# Altium schematic sheet PPO.SchDoc
size B; Organization: Altium Limited; Address1: L3, 12a Rodborough Rd; Address2: Frenchs Forest; Address3: NSW; Address4: Australia 2086
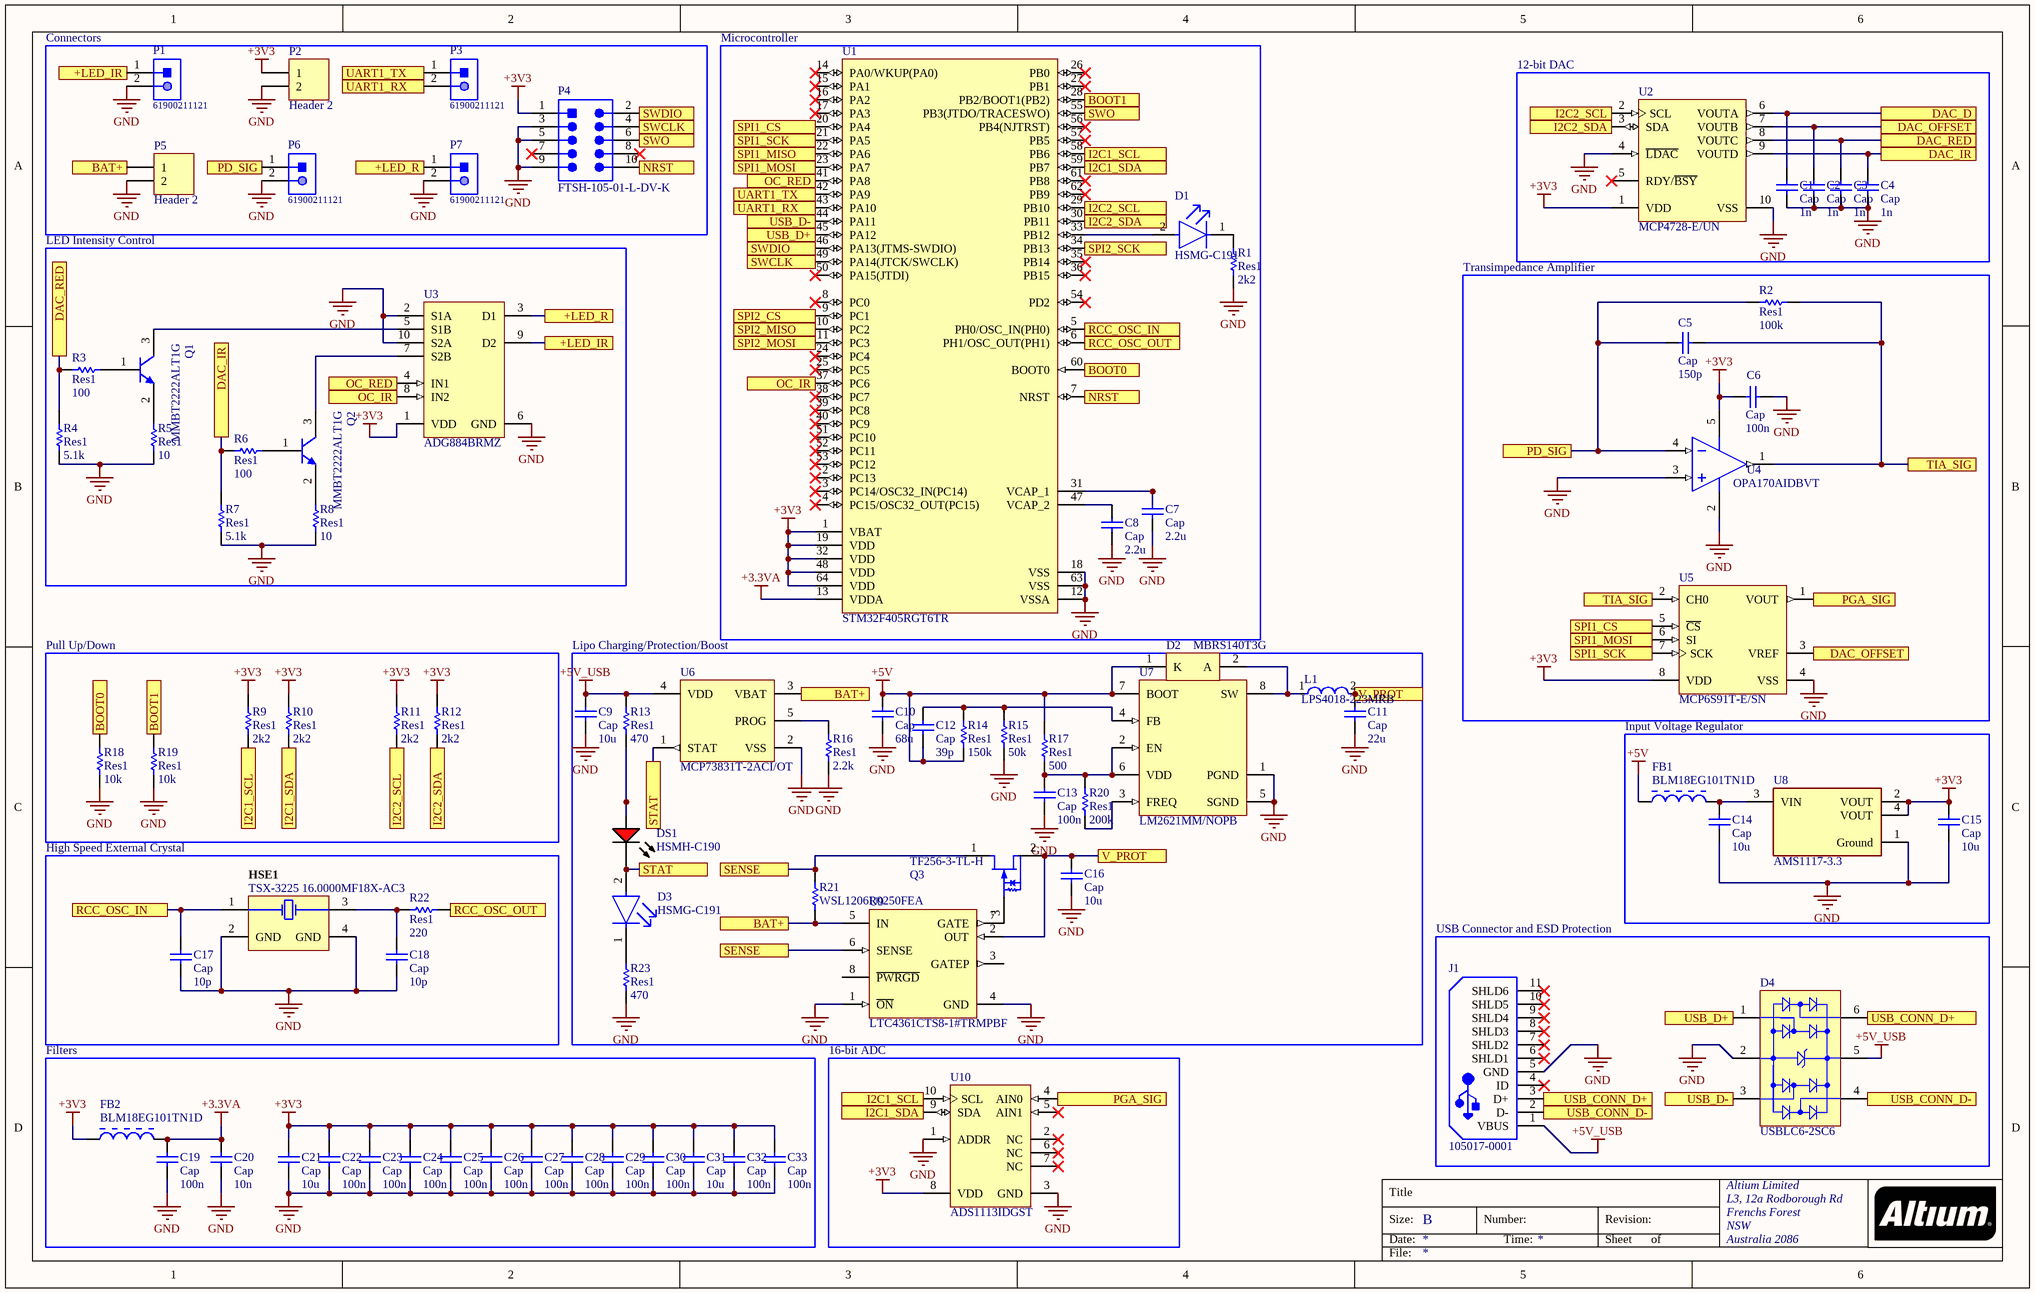
[diagram p0: PPO.SchDoc]

## Parts
C1  Cap  value 1n  [SMD-0402C]
C2  Cap  value 1n  [SMD-0402C]
C3  Cap  value 1n  [SMD-0402C]
C4  Cap  value 1n  [SMD-0402C]
C5  Cap  value 150p  [SMD-0402C]
C6  Cap  value 100n  [SMD-0402C]
C7  Cap  value 2.2u  [SMD-0402C]
C8  Cap  value 2.2u  [SMD-0402C]
C9  Cap  value 10u  [SMD-0402C]
C10  Cap  value 68u  [SMD-0402C]
C11  Cap  value 22u  [SMD-0402C]
C12  Cap  value 39p  [SMD-0402C]
C13  Cap  value 100n  [SMD-0402C]
C14  Cap  value 10u  [SMD-0402C]
C15  Cap  value 10u  [SMD-0402C]
C16  Cap  value 10u  [SMD-0402C]
C17  Cap  value 10p  [SMD-0402C]
C18  Cap  value 10p  [SMD-0402C]
C19  Cap  value 100n  [SMD-0402C]
C20  Cap  value 10n  [SMD-0402C]
C21  Cap  value 10u  [SMD-0402C]
C22  Cap  value 100n  [SMD-0402C]
C23  Cap  value 100n  [SMD-0402C]
C24  Cap  value 100n  [SMD-0402C]
C25  Cap  value 100n  [SMD-0402C]
C26  Cap  value 100n  [SMD-0402C]
C27  Cap  value 100n  [SMD-0402C]
C28  Cap  value 100n  [SMD-0402C]
C29  Cap  value 100n  [SMD-0402C]
C30  Cap  value 100n  [SMD-0402C]
C31  Cap  value 10u  [SMD-0402C]
C32  Cap  value 100n  [SMD-0402C]
C33  Cap  value 100n  [SMD-0402C]
D1  HSMG-C191  [FP-HSMG-C191-MFG]
D2  MBRS140T3G  [ONSC-SMB-2-403A-03_H_V]
D3  HSMG-C191  [FP-HSMG-C191-MFG]
D4  USBLC6-2SC6  [STM-SOT23-6L_V]
DS1  HSMH-C190  [AVAG-HSMX-C190_V]
FB1  BLM18EG101TN1D  [MURA-BLM18-RF-H3-CHIP-2_V]
FB2  BLM18EG101TN1D  [MURA-BLM18-RF-H3-CHIP-2_V]
HSE1  TSX-3225 16.0000MF18X-AC3  [EPSON-TSX-3225_V]
J1  105017-0001  [USB-MICRO-B_V]
L1  LPS4018-223MRB  [FP-LPS4018-MFG]
P1  61900211121  [61900211121]
P2  Header 2  [HDR1X2]
P3  61900211121  [61900211121]
P4  FTSH-105-01-L-DV-K  [SMTC-FTSH-105-01-L-DV-K_V]
P5  Header 2  [HDR1X2]
P6  61900211121  [61900211121]
P7  61900211121  [61900211121]
Q1  MMBT2222ALT1G  [ONSC-SOT-23-3-318-08_V]
Q2  MMBT2222ALT1G  [ONSC-SOT-23-3-318-08_V]
Q3  TF256-3-TL-H  [ONSC-USFP-3-524AC_V]
R1  Res1  value 2k2  [SMD-0402C]
R2  Res1  value 100k  [SMD-0402C]
R3  Res1  value 100  [SMD-0402C]
R4  Res1  value 5.1k  [SMD-0402C]
R5  Res1  value 10  [SMD-0402C]
R6  Res1  value 100  [SMD-0402C]
R7  Res1  value 5.1k  [SMD-0402C]
R8  Res1  value 10  [SMD-0402C]
R9  Res1  value 2k2  [SMD-0402C]
R10  Res1  value 2k2  [SMD-0402C]
R11  Res1  value 2k2  [SMD-0402C]
R12  Res1  value 2k2  [SMD-0402C]
R13  Res1  value 470  [SMD-0402C]
R14  Res1  value 150k  [SMD-0402C]
R15  Res1  value 50k  [SMD-0402C]
R16  Res1  value 2.2k  [SMD-0402C]
R17  Res1  value 500  [SMD-0402C]
R18  Res1  value 10k  [SMD-0402C]
R19  Res1  value 10k  [SMD-0402C]
R20  Res1  value 200k  [SMD-0402C]
R21  WSL1206R0250FEA  [RESC3216X89X51ML25T25]
R22  Res1  value 220  [SMD-0402C]
R23  Res1  value 470  [SMD-0402C]
U1  STM32F405RGT6TR  [STM-LQFP64_L]
U2  MCP4728-E/UN  [MSOP-UN10_N]
U3  ADG884BRMZ  [ADI-RM-10_L]
U4  OPA170AIDBVT  [DBV0005A_L]
U5  MCP6S91T-E/SN  [SOIC-SN8_N]
U6  MCP73831T-2ACI/OT  [SOT-23-OT5_M]
U7  LM2621MM/NOPB  [DGK0008A_N]
U8  AMS1117-3.3  [FP-AMS1117-IPC_C]
U9  LTC4361CTS8-1#TRMPBF  [LT-TS8-8-TSOT-23_V]
U10  ADS1113IDGST  [TI-DGS10_L]

## Blocks framed on the sheet
Connectors: P1-P7
Microcontroller: C7 C8 D1 R1 U1
12-bit DAC: C1-C4 U2
LED Intensity Control: Q1 Q2 R3-R8 U3
Transimpedance Amplifier: C5 C6 R2 U4 U5
Pull Up/Down: R9-R12 R18 R19
Lipo Charging/Protection/Boost: C9-C13 C16 D2 D3 DS1 L1 Q3 R13-R17 R20 R21 R23 U6 U7 U9
Input Voltage Regulator: C14 C15 FB1 U8
High Speed External Crystal: C17 C18 HSE1 R22
USB Connector and ESD Protection: D4 J1
Filters: C19-C33 FB2
16-bit ADC: U10

## Ports
+LED_IR, +LED_R, BAT+, BOOT0, BOOT1, DAC_D, DAC_IR, DAC_OFFSET, DAC_RED, I2C1_SCL, I2C1_SDA, I2C2_SCL, I2C2_SDA, NRST, OC_IR, OC_RED, PD_SIG, PGA_SIG, RCC_OSC_IN, RCC_OSC_OUT, SENSE, SPI1_CS, SPI1_MISO, SPI1_MOSI, SPI1_SCK, SPI2_CS, SPI2_MISO, SPI2_MOSI, SPI2_SCK, STAT, SWCLK, SWDIO, SWO, TIA_SIG, UART1_RX, UART1_TX, USB_CONN_D+, USB_CONN_D-, USB_D+, USB_D-, V_PROT

## Nets
+3.3VA: C19.2 C20.2 FB2.2 U1.13(VDDA)
+3V3: C6.2 C15.2 C21.2 C22.2 C23.2 C24.2 C25.2 C26.2 C27.2 C28.2 C29.2 C30.2 C31.2 C32.2 C33.2 FB2.1 P2.1 P4.1 R9.2 R10.2 R11.2 R12.2 U1.1(VBAT) U1.19(VDD) U1.32(VDD) U1.48(VDD) U1.64(VDD) U2.1(VDD) U3.1(VDD) U4.5(V+) U5.8(VDD) U8.2(VOUT) U8.4(VOUT) U10.8(VDD)
+5V: C10.2 C12.1 D2.1(K) FB1.1 R14.2 R17.1 U7.7(BOOT)
+5V_USB: C9.2 D4.5(VBUS) J1.1(VBUS) R13.2 U6.4(VDD)
GND: C1.1 C2.1 C3.1 C4.1 C6.1 C7.1 C8.1 C9.1 C10.1 C11.1 C13.1 C14.1 C15.1 C16.1 C17.1 C18.1 C19.1 C20.1 C21.1 C22.1 C23.1 C24.1 C25.1 C26.1 C27.1 C28.1 C29.1 C30.1 C31.1 C32.1 C33.1 D4.2(GND) HSE1.2(GND) HSE1.4(GND) J1.5(GND) P1.2 P2.2 P4.3 P4.5 P4.9 P5.2 P6.2 P7.2 R1.1 R4.1 R5.1 R7.1 R8.1 R15.2 R16.2 R18.1 R19.1 R23.2 U1.12(VSSA) U1.18(VSS) U1.63(VSS) U2.4(~{LDAC}) U2.10(VSS) U3.2(S1A) U3.6(GND) U3.10(S2A) U4.2(V-) U4.3(IN+) U5.4(VSS) U6.2(VSS) U7.1(PGND) U7.5(SGND) U8.1(Ground) U9.1(~{ON}) U9.4(GND) U10.1(ADDR) U10.3(GND)
+LED_IR: P1.1 U3.9(D2) ; port +LED_IR
+LED_R: P7.1 U3.3(D1) ; port +LED_R
BAT+: P5.1 R21.1 U6.3(VBAT) U9.5(IN) ; port BAT+
BOOT0: R18.2 U1.60(BOOT0) ; port BOOT0
BOOT1: R19.2 U1.28(PB2/BOOT1(PB2)) ; port BOOT1
DAC_D: C1.2 U2.6(VOUTA) ; port DAC_D
DAC_IR: C4.2 R6.2 R7.2 U2.9(VOUTD) ; port DAC_IR
DAC_OFFSET: C2.2 U2.7(VOUTB) U5.3(VREF) ; port DAC_OFFSET
DAC_RED: C3.2 R3.2 R4.2 U2.8(VOUTC) ; port DAC_RED
I2C1_SCL: R9.1 U1.58(PB6) U10.10(SCL) ; port I2C1_SCL
I2C1_SDA: R10.1 U1.59(PB7) U10.9(SDA) ; port I2C1_SDA
I2C2_SCL: R11.1 U1.29(PB10) U2.2(SCL) ; port I2C2_SCL
I2C2_SDA: R12.1 U1.30(PB11) U2.3(SDA) ; port I2C2_SDA
NRST: P4.10 U1.7(NRST) ; port NRST
OC_IR: U1.37(PC6) U3.8(IN2) ; port OC_IR
OC_RED: U1.41(PA8) U3.4(IN1) ; port OC_RED
PD_SIG: C5.2 P6.1 R2.2 U4.4(IN-) ; port PD_SIG
PGA_SIG: U5.1(VOUT) U10.4(AIN0) ; port PGA_SIG
RCC_OSC_IN: C17.2 HSE1.1(X1) U1.5(PH0/OSC_IN(PH0)) ; port RCC_OSC_IN
RCC_OSC_OUT: R22.2 U1.6(PH1/OSC_OUT(PH1)) ; port RCC_OSC_OUT
SENSE: Q3.1(D) R21.2 U9.6(SENSE) ; port SENSE
SPI1_CS: U1.20(PA4) U5.5(~{CS}) ; port SPI1_CS
SPI1_MISO: U1.22(PA6) ; port SPI1_MISO
SPI1_MOSI: U1.23(PA7) U5.6(SI) ; port SPI1_MOSI
SPI1_SCK: U1.21(PA5) U5.7(SCK) ; port SPI1_SCK
SPI2_CS: U1.9(PC1) ; port SPI2_CS
SPI2_MISO: U1.10(PC2) ; port SPI2_MISO
SPI2_MOSI: U1.11(PC3) ; port SPI2_MOSI
SPI2_SCK: U1.34(PB13) ; port SPI2_SCK
STAT: D3.2(A) DS1.2(K) U6.1(STAT) ; port STAT
SWCLK: P4.4 U1.49(PA14(JTCK/SWCLK)) ; port SWCLK
SWDIO: P4.2 U1.46(PA13(JTMS-SWDIO)) ; port SWDIO
SWO: P4.6 U1.55(PB3(JTDO/TRACESWO)) ; port SWO
TIA_SIG: C5.1 R2.1 U4.1(OUT) U5.2(CH0) ; port TIA_SIG
UART1_RX: P3.2 U1.43(PA10) ; port UART1_RX
UART1_TX: P3.1 U1.42(PA9) ; port UART1_TX
USB_CONN_D+: D4.6(I/O_4) J1.3(D+) ; port USB_CONN_D+
USB_CONN_D-: D4.4(I/O_3) J1.2(D-) ; port USB_CONN_D-
USB_D+: D4.1(I/O_1) U1.45(PA12) ; port USB_D+
USB_D-: D4.3(I/O_2) U1.44(PA11) ; port USB_D-
V_PROT: C11.2 C16.2 L1.2 Q3.2(S) U9.2(OUT) ; port V_PROT
NetC7_2: C7.2 U1.31(VCAP_1)
NetC8_2: C8.2 U1.47(VCAP_2)
NetC12_2: C12.2 R14.1 R15.1 U7.4(FB)
NetC13_2: C13.2 R17.2 R20.1 U7.2(EN) U7.6(VDD)
NetC14_2: C14.2 FB1.2 U8.3(VIN)
NetC18_2: C18.2 HSE1.3(X2) R22.1
NetD1_1: D1.1(C) R1.2
NetD1_2: D1.2(A) U1.33(PB12)
NetD2_2: D2.2(A) L1.1 U7.8(SW)
NetD3_1: D3.1(C) R23.1
NetDS1_1: DS1.1(A) R13.1
NetQ1_1: Q1.1(B) R3.1
NetQ1_2: Q1.2(E) R5.2
NetQ1_3: Q1.3(C) U3.5(S1B)
NetQ2_1: Q2.1(B) R6.1
NetQ2_2: Q2.2(E) R8.2
NetQ2_3: Q2.3(C) U3.7(S2B)
NetQ3_3: Q3.3(G) U9.7(GATE)
NetR16_1: R16.1 U6.5(PROG)
NetR20_2: R20.2 U7.3(FREQ)

Not connected (* = marked no-connect by the designer): J1 4(ID)* 6(SHLD1)* 7(SHLD2)* 8(SHLD3)* 9(SHLD4)* 10(SHLD5)* 11(SHLD6)*; P4 7* 8*; U1 2(PC13)* 3(PC14/OSC32_IN(PC14))* 4(PC15/OSC32_OUT(PC15))* 8(PC0)* 14(PA0/WKUP(PA0))* 15(PA1)* 16(PA2)* 17(PA3)* 24(PC4)* 25(PC5)* 26(PB0)* 27(PB1)* 35(PB14)* 36(PB15)* 38(PC7)* 39(PC8)* 40(PC9)* 50(PA15(JTDI))* 51(PC10)* 52(PC11)* 53(PC12)* 54(PD2)* 56(PB4(NJTRST))* 57(PB5)* 61(PB8)* 62(PB9)*; U2 5(RDY/~{BSY})*; U9 3(GATEP) 8(~{PWRGD}); U10 2(NC)* 5(AIN1)* 6(NC)* 7(NC)*

## Notes on the sheet
- Title
- Size:
- Date:
- B
- Number:
- Time:
- Revision:
- Sheet
- of
- File:

## Library data of the parts
C1-C33 = Cap: Capacitor; Published: 8-Jun-2000; LatestRevisionDate: 17-Jul-2002; LatestRevisionNote: Re-released for DXP Platform.; PackageReference: RAD-0.3; Publisher: Altium Limited; PackageDescription: Radial Cap, Thru-Hole; 2 Leads; 0.3 in Pin Spacing
D1 D3 = CMP-18399-000001-1: LED GREEN DIFFUSED CHIP SMD; Manufacturer: Broadcom; Viewing Angle: 170°; Max Junction Temp: +95°C; Wavelength: 572nm; Peak Emmision Wavelength: 570nm; Led Orientation: Top View; Luminous Intensity: 15mcd; Reverse Voltage: 5V; Forward Current: 20mA; Forward Voltage: 2.2V; Power Dissipation: 52mW; Ipc Land Pattern Name: DIOC16080X45; Digikey Description: LED GREEN DIFFUSED CHIP SMD; Temperature Range High: +85°C; Height: 0.7mm; Automotive: No; Footprint 0 Description: SM LED; 2 Flat Leads; Device Class L3: unset; ComponentLink2Description: Datasheet; Lead Free: Yes; Package: 0; Mouser Description: LED Uni-Color Green 570nm 2-Pin Chip LED T/R; RoHS: TRUE; Category: Diode; Manufacturer Part Number: HSMG-C191; Device Class L1: Optoelectronics; Temperature Range Low: -40°C; Device Class L2: LEDs; Colour: Green; Octopart: https://octopart.com/hsmg-c191-broadcom-71131308; Temperature: -40°C to +85°C; ComponentLink2URL: https://docs.broadcom.com/docs/AV02-0551EN
D2 = CMP-1055-00347-1: Schottky Power Rectifier, 2-Pin SMB, Pb-Free, Tape and Reel; Manufacturer: On Semiconductor; Configuration: Single; IFSM Max (A): 40; PackageDescription: 2-Pin Small Molded Package, J-Bend Lead, Body 4.33 x 3.625 mm; PartNumber: MBRS140T3G; PackageReference: SMB-2-403A-03_H; ComponentLink1URL: http://www.onsemi.com/; ComponentLink2URL: http://www.onsemi.cn/pub_link/Collateral/MBRS140T3-D.PDF; PackageVersion: Rev. H, 05/2011; ComponentLink3URL: http://www.onsemi.com/pub_link/Collateral/1SMB5913BT3-D.PDF; Packing: Tape and Reel; ComponentLink1Description: Manufacturer URL; DatasheetVersion: Rev. 9; Mounting Technology: Surface Mount; RoHS: TRUE; ComponentLink3Description: Package Specification; ComponentLink2Description: Datasheet
D4 = CMP-2000-05378-1: Very low capacitance ESD protection, 3.5 pF, -40 to 125 degC, 6-Pin SOT23, RoHS, Tape and Reel; Manufacturer: STMicroelectronics; Polarity: Uni-Directional; Clamping Voltage: 17V; Rad Hardened: No; Product Height (mm): 1.3mm; Leakage Current (Max): 0.15uA; Product Length (mm): 3.05mm; Number of Elements: 1; Peak Pulse Current: 5A; Configuration: Dual; Reverse Breakdown Voltage: 6V; Working Voltage (Max): 5V; Capacitance Value: 3.5pF; Suppressor Type: DiodeArrays; Product Depth (mm): 1.75mm; Test Current (It): 1mA; Package / Case: SOT-23; Operating Temperature Max Deg. C: 125C; Package Description: 6-Pin Small Outline Transistor, Body 2.925 x 1.625 mm, Pitch 0.95 mm; Package Reference: SOT23-6L; Datasheet Version: Rev. 5, 10/2011; Operating Temperature Min Deg. C: -40C; Mounting Style: SurfaceMount; Direction Type: Uni-Directional; Mounting: SurfaceMount; Pin Count: 6; Leakage Current: 0.15uA; Packaging: TapeandReel; Operating Temperature Classification: Automotive; Clamping Voltage (Max): 17V; Manufacturer URL: http://www.st.com/; Reverse Stand-off Voltage: 5V; Datasheet URL: http://www.st.com/st-web-ui/static/active/en/resource/technical/document/datasheet/CD00050750.pdf; Working Voltage: 5V; Operating Temp Range: -40Cto125C
DS1 = CMP-1744-00004-1: LED Uni-Color Red, 65 mW, 20 mA, -40 to 85 degC, 2-Pin SMD, RoHS, Tape and Reel; Connector Type: USB; Gender: Male; Current Rating: 1 A; Length: 7.5 mm; Lead Pitch: 0.65 mm; PackageReference: HSMX-C190; Package Quantity: 2000; Max Operating Temperature: 85 degC; PackageDescription: 2-Pin Surface Mount Device, Body 1.6 x 0.8 mm, Height 0.9 mm; ComponentLink3Description: Package Specification; Mount: Surface Mount; Min Operating Temperature: -30 degC; ComponentLink3URL: http://www.fairchildsemi.com/dwg/MA/MA03D.pdf; ComponentLink1Description: Manufacturer URL; Contact Material: Copper; Pins: 5; Width: 5.6 mm; ComponentLink2Description: Datasheet; RoHSCompliant: true; DatasheetVersion: Mar-12; Height: 2.8 mm; Packaging: Tape and Reel; Contact Plating: Gold; ComponentLink1URL: http://www.avagotech.com/; REACH SVHC: No SVHC; ComponentLink2URL: http://docs.avagotech.com/docs/AV02-0551EN
FB1 FB2 = CMP-0686-00530-2: Chip Ferrite Bead for GHz Band General Use (Low DC Resistance Type), 100 Ohm, 2000 mA, -55 to 125 degC, 1.6 x 0.8 x 0.65 mm SMD, Tape and Reel; Manufacturer: Murata; Rated Current: 2000 mA; Impedance (at 100 MHz): 100 Ohm +/- 25%; DC Resistance: 0.045 Ohm Max.; ComponentLink3Description: Package Specification; ComponentLink2URL: http://www.murata.com/products/catalog/pdf/c31e.pdf; DatasheetVersion: 08/2013; ComponentLink1Description: Manufacturer URL; Packing: Tape and Reel; PackageDescription: 2-Pin Chip, Body 1.6 x 0.8 mm; Operating Temperature Range: -55 to 125 degC; ComponentLink1URL: http://www.murata.com/; ComponentLink2Description: Datasheet; Mounting Technology: Surface Mount; PartNumber: BLM18EG101TN1D; ComponentLink3URL: http://www.murata.com/products/catalog/pdf/c31e.pdf; PackageReference: BLM18_H650-2
HSE1 = CMP-2000-07332-1: MHz Range Crystal Unit, 16 MHz, -40 to 85 degC, 4-Pin SMD, RoHS, Tape and Reel; Manufacturer: Epson; Unit Weight: 0.000564oz; Tolerance: 10PPM; ESR: 60Ohms; Frequency: 16MHz; Drive Level: 200uW; Brand: EpsonTiming; Load Capacitance: 9pF; Product Category: Crystals; Packaging: Reel; Termination Style: SMD/SMT; Width: 2.5mm; Length: 3.2mm; Type: Crystal; Datasheet Version: 12/2015; Factory Pack Quantity: 250; Package Description: 4-Pin Surface Mount Device, Body 3.2 x 2.5 mm; Package / Case: 3.2mmx2.5mm; Mounting Style: SMD/SMT; Series: TSX-3225; Frequency Stability: 10PPM; Package Reference: TSX-3225; Mounting Technology: SurfaceMount; RoHS: True; Height: 0.6mm; Datasheet URL: https://support.epson.biz/td/api/doc_check.php?dl=brief_FA-238V_en.pdf; Operating Temperature Range: -40Cto+85C; Manufacturer URL: https://www.eea.epson.com/
J1 = CMP-2000-05827-1: Micro-USB B Receptacle, Right Angle, Bottom Mount, Surface Mount, with Solder Tabs, -30 to 85 degC, 5-Pin USB, RoHS, Tape and Reel; Manufacturer: Molex; Featured Product: Micro-USBConnectorsUSBConnectors; Other Names: WM1399DKR; Package Version: Rev. F, 12/2012; Number of Contacts: 5; Connector Type: USB-microB; Catalog Drawings: 1050170001; 3D Model: 105017-0001.stp; Mating Products: WM17145-ND-CABLEMICROUSBBTOSTDA1.0MWM17147-ND-CABLEMICROUSBBTOSTDA2.0MWM17146-ND-CABLEMICROUSBBTOSTDA1.5M; PCN Assembly/Origin: ResinSupplier21/Oct/2015; Voltage - Max: 30V; Online Catalog: Molex-MicroUSB; Manufacturer URL: http://www.molex.com/; Package Description: 5-Leads USB, Micro B, Body 7.5 x 5 mm, Pitch 0.65 mm; Datasheet URL: http://www.molex.com/elqNow/elqRedir.htm?ref=http://www.molex.com/webdocs/datasheets/pdf/en-us/1050170001_IO_CONNECTORS.pdf; Ingress Protection: -; Datasheet Version: 03/2016; Mounting Type: BoardCutout,SurfaceMount,RightAngle; Circuits: 5; Standard Package: 1; Package Reference: MICRO-B; Package URL: http://www.molex.com/pdm_docs/sd/1050170001_sd.pdf; Category: Connectors,Interconnects; Series: -; RoHS Information: 1050170001CertofCompliance; Features: Shielded,SolderRetention; Family: USB,DVI,HDMIConnectors; Specifications: -; Gender: Receptacle; Packaging: Digi-Reel®; Mounting Technology: SurfaceMount
L1 = CMP-11268-000004-1: Power inductor, shielded, 20/30% tol, SMT, RoHS, lead-free, halogen-free; Manufacturer: Coilcraft; Inductance: 22uH; Series Resistance: 0.36Ω; Test Frequency: 1MHz; Self Resonant Frequency: 26MHz; Tolerance: 20%; Core Material: Ferrite; Value: 22uH; Automotive Grade: Grade 3; Rms Current: 0.9A; Saturation Current: 0.8A; Shielding: true; RoHS: TRUE; Device Class L3: Fixed Inductors; Category: Ind; Lead Free: Yes; ComponentLink2URL: https://www.coilcraft.com/pdfs/lps4018.pdf; Height: 1.8mm; Mouser Description: Power inductor, shielded, 20/30% tol, SMT, RoHS, lead-free, halogen-free; Ambient Temperature Range High: +85°C; Ambient Temperature Range Low: -40°C; Manufacturer Part Number: LPS4018-223MRB; Device Class L2: Inductors; Package: LPS4018; Device Class L1: Passive Components; Octopart: https://octopart.com/lps4018-223mrb-coilcraft-30061092; ComponentLink2Description: Datasheet; Automotive: Yes
P1 P3 P6 P7 = CMP-1502-00584-1: Male Locking Header WR-WTB, THT, Vertical, pitch 2.54 mm, 1 x 2 position; Manufacturer: Wurth Elektronik; Position: 1x2; Contact Resistance: 20mOhm; Working Voltage: 250VAC; Pitch: 2.54mm; Gender: Male; Part Number: 61900211121; Mounting Technology: THT; Operating Temperature: -40to105degC; Orientation: Vertical; Packaging: Bag; Package Reference: 61900211121; Manufacturer URL: http://www.we-online.de; Datasheet URL: https://katalog.we-online.de/em/datasheet/6190xx11121.pdf; Publisher: WurthElektronik
P2 P5 = Header 2: Header, 2-Pin; LatestRevisionDate: 17-Jul-2002; LatestRevisionNote: Re-released for DXP Platform.; Publisher: Altium Limited
P4 = CMP-2000-05353-1: Male Header, Pitch 1.27 mm, 2 x 5 Position, Height 6.25 mm; Manufacturer: Samtec; Pitch: 0.050"(1.27mm); Other Names: Q3937619; Number of Positions: 10; Mating Products: SFMC-105-L2-S-D-TR-ND / -CONN.05"SURFACE10POSSMT / FLE-105-01-G-DV-TR-ND / -CONNSKT1.27MM10POSDUALSMD / FLE-105-01-G-DV-A-P-ND / -CONNSKT1.27MM10POSDUALSMD / FLE-105-01-G-DV-A-ND / -CONNSKT1.27MM10POSDUALSMD / CLP-105-02-G-D-P-TR-ND / -CONNRCPT10POSDUAL.05"SMD / SAM1155-05-ND / -CONNRCPT10POSDUAL.05"SMD / SAM1154-05-ND / -CONNRCPT10POSDUAL.05"SMD / SAM1153-05-ND / -CONNRCPT10POSDUAL.05"SMD / SAM1226-05-ND / -CONNRCPT.05"10POSDUALSMD; Number of Positions Loaded: All; Connector Type: Header,Unshrouded; Product Training Modules: Board-to-BoardConnectors; Datasheet Version: Rev. ET, 10/1995; Number of Rows: 2; Standard Package: 1; Package Description: Male Header, Pitch 1.27 mm, 2 x 5 Position, Height 5.97 mm, Tail Length 4.32 mm; Contact Finish Thickness: 10µin(0.25µm); Series: FTSH; Termination: Solder; Contact Type: MalePin; Color: Black; Package Reference: FTSH-105-01-L-DV-K; Family: RectangularConnectors-Headers,MalePins; Package URL: http://suddendocs.samtec.com/prints/ftsh-1xx-xx-xxx-dv-xxx-footprint.pdf; Packaging: Tube; Mounting Type: SurfaceMount; Category: Connectors,Interconnects; Datasheet URL: http://suddendocs.samtec.com/prints/ftsh-1xx-xx-xxx-dv-xxx-mkt.pdf; Row Spacing: 0.050"(1.27mm); Manufacturer URL: http://www.samtec.com/; Contact Mating Length: 0.120"(3.05mm); Contact Finish: Gold
Q1 Q2 = CMP-1048-00538-1: General Purpose Transistor, NPN Silicon, 3-Pin SOT-23, Pb-Free, Tape and Reel; Manufacturer: On Semiconductor; fT Min (MHz): 300; IC Continuous (A): 0.6; ComponentLink3URL: http://www.onsemi.cn/pub_link/Collateral/318-08.PDF; PartNumber: MMBT2222ALT1G; RoHS: TRUE; ComponentLink1URL: http://www.onsemi.com/; ComponentLink3Description: Package Specification; ComponentLink2Description: Datasheet; Mounting Technology: Surface Mount; Packing: Tape and Reel; PackageDescription: 3-Pin Small Outline Transistor, Body 2.92 x 1.3 mm, Pitch 0.95 mm; DatasheetVersion: Rev. 10; PackageReference: SOT-23-3-318-08; ComponentLink2URL: http://www.onsemi.cn/pub_link/Collateral/MMBT2222LT1-D.PDF; Polarity: NPN; PackageVersion: Rev. AP, 11/2009; ComponentLink1Description: Manufacturer URL
Q3 = CMP-1062-00084-1: N-Channel JFET, 20 V, 100 to 180 uA, 1.7 mS, 3-Pin USFP, Pb-Free, Tape and Reel; Manufacturer: On Semiconductor; Channel Polarity: N Channel; IDSS Min (uA): 100; IDSS Max (uA): 180; ComponentLink1Description: Manufacturer URL; ComponentLink3Description: Package Specification; PackageReference: USFP-3-524AC; PackageVersion: Rev. O, 02/2012; ComponentLink2URL: http://www.onsemi.com/pub_link/Collateral/ENA1616-D.PDF; ComponentLink2Description: Datasheet; PartNumber: TF256-3-TL-H; ComponentLink3URL: http://www.onsemi.com/pub_link/Collateral/524AC.PDF; Packing: Tape and Reel; ComponentLink1URL: http://www.onsemi.com/; Mounting Technology: Surface Mount; RoHS: Pb-Free; PackageDescription: 3-Pin Small Outline Transistor, Body 0.8 x 0.6 mm, Pitch 0.175 mm
R1-R20 R22 R23 = Res1: Resistor; Published: 8-Jun-2000; LatestRevisionDate: 17-Jul-2002; LatestRevisionNote: Re-released for DXP Platform.; PackageReference: AXIAL-0.3; Publisher: Altium Limited; PackageDescription: Axial Device, Thru-Hole; 2 Leads; 0.3 in Pin Spacing
R21 = CMP-2003-04354-1: Manufacturer: Vishay Dale; Part Number: WSL1206R0250FEA
U1 = CMP-0243-00156-1: ARM Cortex-M4 32-bit MCU+FPU, 1024 KB Flash, 192 KB Internal RAM, 51 I/Os, 64-Pin LQFP, -40 to 85 degC, Tape and Reel; Internal RAM Size (kB): 192; FLASH Size (Prog) (kB): 1024; Supply Voltage(Vcc) min (V): 1.8; D/A Converter: 2; Operating Frequency(F) (Processor speed) (MHz): 168; I/Os (High Current): 51; DatasheetVersion: Rev. 6; Package Description: LQFP64; ComponentLink2Description: Datasheet; ComponentLink1Description: Manufacturer URL; Packing: Tape and Reel; Mounting Technology: Surface Mount; Package Reference: 64-Pin Low-profile Quad Flat Package, Body 10 x 10 mm, Pitch 0.5 mm; ComponentLink2URL: http://www.st.com/st-web-ui/static/active/en/resource/technical/document/datasheet/DM00037051.pdf; ComponentLink1URL: http://www.st.com/; Core: ARM Cortex-M4
U2 = CMP-0188-01008-2: 12-Bit Quad Digital-to-Analog Converter with EEPROM Memory, 10-pin MSOP, Extended Temperature; ComponentLink2URL: http://ww1.microchip.com/downloads/en/DeviceDoc/22187E.pdf; ComponentLink3Description: Package Specification; PackageReference: MSOP-UN10; ComponentLink3URL: http://www.microchip.com/stellent/groups/techpub_sg/documents/packagingspec/en012702.pdf; ComponentLink2Description: Datasheet; PackageDescription: 10-Lead Plastic Micro Small Outline Package (UN) [MSOP]; DatasheetVersion: revE, Oct-2010; RevisionNote: URLs added. DatasheetVersion updated.; PackageVersion: revBB, Aug-2009; ComponentLink1Description: Manufacturer URL; ComponentLink1URL: http://www.microchip.com/
U3 = CMP-0790-00116-1: 0.5 Ohm CMOS, Dual 2:1 MUX / SPDT Audio Switches, -40 to 85 degC, 10-pin SOP (RM-10), Tube; Manufacturer: Analog Devices; Max Pos Supply: 5.5V; Is OFF: 200pA, 200pA, 200pA; Min Pos Supply: 1.8V; Ron (ohms): 0.5; Power Dissipation: 5.5uW; # Sw Functions: 2; ComponentLink2URL: http://www.analog.com/static/imported-files/data_sheets/ADG884.pdf; Packing: Tube; PackageDescription: 10-Pin Mini Small Outline Package, Body 3 x 3 mm, Pitch 0.5 mm; ComponentLink3URL: http://www.analog.com/static/imported-files/packages/PKG_PDF/MSOP%28RM%29/RM_10.pdf; ComponentLink3Description: Package Specification; PackageVersion: Aug-05; DatasheetVersion: Rev. D; PartNumber: ADG884BRMZ; Configuration: SPDT; Id, Is (ON): 200pA, 200pA, 200pA; ComponentLink2Description: Datasheet; ComponentLink1URL: http://www.analog.com/en/index.html; Code_JEDEC: MO-187-BA; Mounting Technology: Surface Mount; ComponentLink1Description: Manufacturer URL; PackageReference: RM-10
U4 = CMP-0272-00932-3: MicroPower, Rail-to-Rail Output, General Purpose Operational Amplifier, 2.7 to 36 V, -40 to 125 degC, 5-pin SOT23 (DBV5), Green (RoHS & no Sb/Br); Manufacturer: Texas Instruments; Total Supply Voltage(Min)(+5V is 5, +/-5V is 10): 2.7; Rating: Catalog; Vio (25C)(Max)(mV): 1.8; Packing: SMALL T&R; GBW(Typ)(MHz): 1.2; Sub Family: High Supply Voltage Amplifier (>=30V), Low Power Amp (<=500uA), Low Supply Voltage Amplifier (<=2.7V), Precision Amplifier; CMRR(Min)(dB): 104; Iq per channel(Max)(mA): 0.145; Number of Channels: 1; IIB(Max)(pA): 15; Offset Drift(Typ)(uV/C): 0.3; Total Supply Voltage(Max)(+5V is 5, +/-5V is 10): 36; Slew Rate(Typ)(V/us): 0.4; ComponentLink2Description: Datasheet; PackageReference: DBV0005A; ComponentLink1URL: http://www.ti.com/; DatasheetVersion: SBOS557B; ComponentLink1Description: Manufacturer URL; Mounting Technology: Surface Mount; ComponentLink3Description: Package Specification; ComponentLink3URL: http://www.ti.com/litv/pdf/mpds018i; PackageDescription: 5-Pin Plastic Small Outline, Body 1.6 x 2.9 mm, Pitch 0.95 mm; Eco-Plan: Green (RoHS & no Sb/Br); PackageVersion: 4073253-4/K, 03/2006; PartNumber: OPA170AIDBVT; ComponentLink2URL: http://www.ti.com/lit/ds/symlink/opa170.pdf; Code_JEDEC: MO-178
U5 = CMP-0187-00272-2: Single-Ended, Rail-to-Rail Input/Output, Low-Gain Programmable Gain Amplifier, 8-Pin SOIC, Extended Temperature, Tape and Reel; Code_JEDEC: MS-012; ComponentLink1Description: Manufacturer URL; ComponentLink2Description: Datasheet; DatasheetVersion: revA, Oct-2004; ComponentLink3URL: http://www.microchip.com/stellent/groups/techpub_sg/documents/packagingspec/en012702.pdf; PackageVersion: revBB, Aug-2009; RevisionNote: URLs added.; ComponentLink2URL: http://ww1.microchip.com/downloads/en/DeviceDoc/21908a.pdf; PackageDescription: 8-Lead Plastic Small Outline (SN) - Narrow, 3.90mm Body [SOIC]; ComponentLink1URL: http://www.microchip.com/; PackageReference: SOIC-SN8; ComponentLink3Description: Package Specification; Code_IPC: SOIC127P600-8
U6 = CMP-0133-00143-1: Miniature Single-Cell, Fully Integrated Li-Ion, Li-Polymer Charge Management Controller, 4.2V, 5-Pin SOT-23, Industrial Temperature, Tape and Reel; PackageReference: SOT-23-OT5; PackageDescription: 5-Lead Plastic Small Outline Transistor (OT) [SOT-23]; PackageVersion: revBB, Aug-2009; DatasheetVersion: revE, Sep-2008; Code_IPC: SOT23-5
U7 = CMP-0069-01749-3: Low Input Voltage, Step-Up DC-DC, 8-pin MSOP, Pb-Free; Manufacturer: Texas Instruments; PowerWise: N; CompType: Switcher; PackageTopMarking: ZXTT*S06A; PackageDescription: MINI SOIC, .118 x .118 x .034in, 8 Lead, .0256in Pitch; Code_JEDEC: MO-187-AA; PinCount: 8; ComponentLink1URL: http://www.ti.com/general/docs/lit/getliterature.tsp?genericPartNumber=LM2621&fileType=pdf; PackageReference: DGK0008A; RoHS: Y; ComponentLink1Description: Datasheet URL
U8 = CMP-209535-000001-1: LDO Voltage Regulators 1A, 3.3V; Manufacturer: Advanced Monolithic Systems; Dropout Voltage: 1.1V; Output Type: Fixed; Nominal Supply Current: 5mA; Max Power Dissipation: 1.2W; Max Supply Voltage: 15V; Number Of Outputs: 1; Standoff Height: 0.64mm; Max Junction Temp: +125°C; Height: 1.8mm; Package: AMS1117; Device Class L2: Power Management ICs; ComponentLink2Description: Datasheet; ComponentLink2URL: http://www.advanced-monolithic.com/pdf/ds1117.pdf; Category: IC; RoHS: TRUE; Automotive: No; Device Class L1: Integrated Circuits (ICs); Output Current: 1A; Device Class L3: Voltage Regulators - Linear; Temperature: -40°C to +125°C; Output Voltage: 3.3V; Manufacturer Part Number: AMS1117-3.3; Temperature Range Low: -40°C; Octopart: https://octopart.com/ams1117-3.3-advanced+monolithic+systems-25899300; Lead Free: Yes; Ipc Land Pattern Name: SOT229P700X180-4; Temperature Range High: +125°C
U9 = CMP-0474-00885-1: Overvoltage / Overcurrent Protection Controller, 2.5 to 80 V Vin, 8-pin SOT23 (TS8-8), 0 to 70 degC, Pb-Free, Mini Tape and Reel; Manufacturer: Linear Technology; Active Limiting: no; Extended Temp: C, I, H; Circuit Breaker Threshold: 50 mV; Circuit Breakers(#): 1; Power Good: yes; Circuit Breaker Accuracy(%): 10; Packing: Mini Tape and Reel; ComponentLink2Description: Datasheet; ComponentLink1Description: Manufacturer URL; PackageReference: TS8-8; ComponentLink3URL: http://cds.linear.com/docs/en/packaging/SOT_8_05-08-1637.pdf; Vin Range: 2.5 to 80 V; ComponentLink3Description: Package Specification; ComponentLink2URL: http://cds.linear.com/docs/en/datasheet/436112fb.pdf; Reset: no; PackageVersion: Rev. A, 08/2010; RoHS: TRUE; Fast Comparator: no; Code_JEDEC: MO-193; PartNumber: LTC4361CTS8-1#TRMPBF; ComponentLink1URL: http://www.linear.com/; PackageDescription: 8-Pin Plastic TSOT-23, Body 2.9 x 1.63 mm, Pitch 0.65 mm; Mounting Technology: Surface Mount; Foldback: no; Fault: no; DatasheetVersion: Rev. B
U10 = CMP-0003-00386-2: 16-Bit ADC with Integrated Multiplexer, Oscillator, and Reference, -40 to 125 degC, 10-pin SOP (DGS10), Green (RoHS & no Sb/Br); Manufacturer: Texas Instruments; Resolution(Bits): 16; INL(Max)(+/-LSB): 1; Interface: Serial I2C; Analog Voltage AV/DD(Max)(V): 5.5; Analog Voltage AV/DD(Min)(V): 2; SubFamily: Precision ADC (<=10MSPS); Architecture: Delta-Sigma; Sample Rate (max)(SPS): 860; ComponentLink2URL: http://www.ti.com/general/docs/lit/getliterature.tsp?genericPartNumber=ADS1113&fileType=pdf; Mounting Technology: Surface Mount; ComponentLink3Description: Package Specification; PartNumber: ADS1113IDGST; PackageDescription: 10-Pin Plastic Small Outline, Body 3 x 3 mm, Pitch 0.5 mm; ComponentLink1URL: http://www.ti.com/; PackageReference: DGS10; Eco-Plan: Green (RoHS & no Sb/Br); ComponentLink3URL: http://www.ti.com/lit/ml/mpds035b/mpds035b.pdf; PackageVersion: 4073272/C, 02/2004; Code_JEDEC: MO-153; ComponentLink2Description: Datasheet; # Input Channels: 1; ComponentLink1Description: Manufacturer URL; Digital Supply(Min)(V): 2; DatasheetVersion: SBAS444B; Digital Supply(Max)(V): 5.5